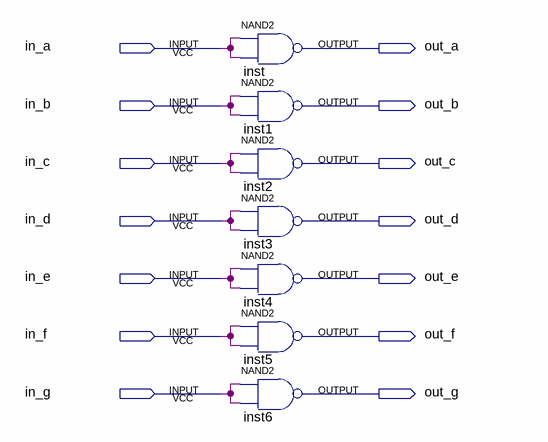
[diagram p0: schematic sheet]
// Quartus schematic NOT_A-G.bdf as structural Verilog: 7 symbols, 14 pins
module \NOT_A-G  (
  input  in_a,
  input  in_b,
  input  in_c,
  input  in_d,
  input  in_e,
  input  in_f,
  input  in_g,
  output out_a,
  output out_b,
  output out_c,
  output out_d,
  output out_e,
  output out_f,
  output out_g
);

  nand inst (out_a, in_a, in_a);
  nand inst1 (out_b, in_b, in_b);
  nand inst2 (out_c, in_c, in_c);
  nand inst3 (out_d, in_d, in_d);
  nand inst4 (out_e, in_e, in_e);
  nand inst5 (out_f, in_f, in_f);
  nand inst6 (out_g, in_g, in_g);
endmodule
